# EAGLE schematic POVRotor (EAGLE 8.4.1)
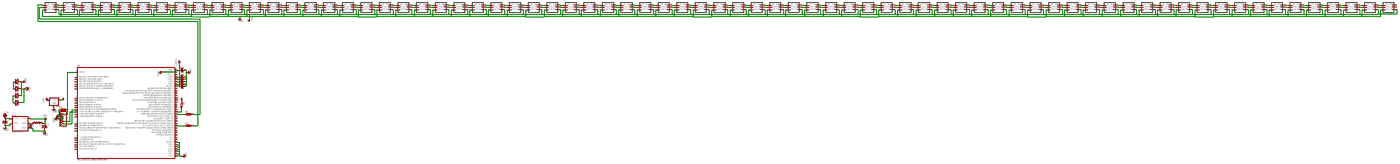
[diagram p0: schematic, sheet 1, overview]
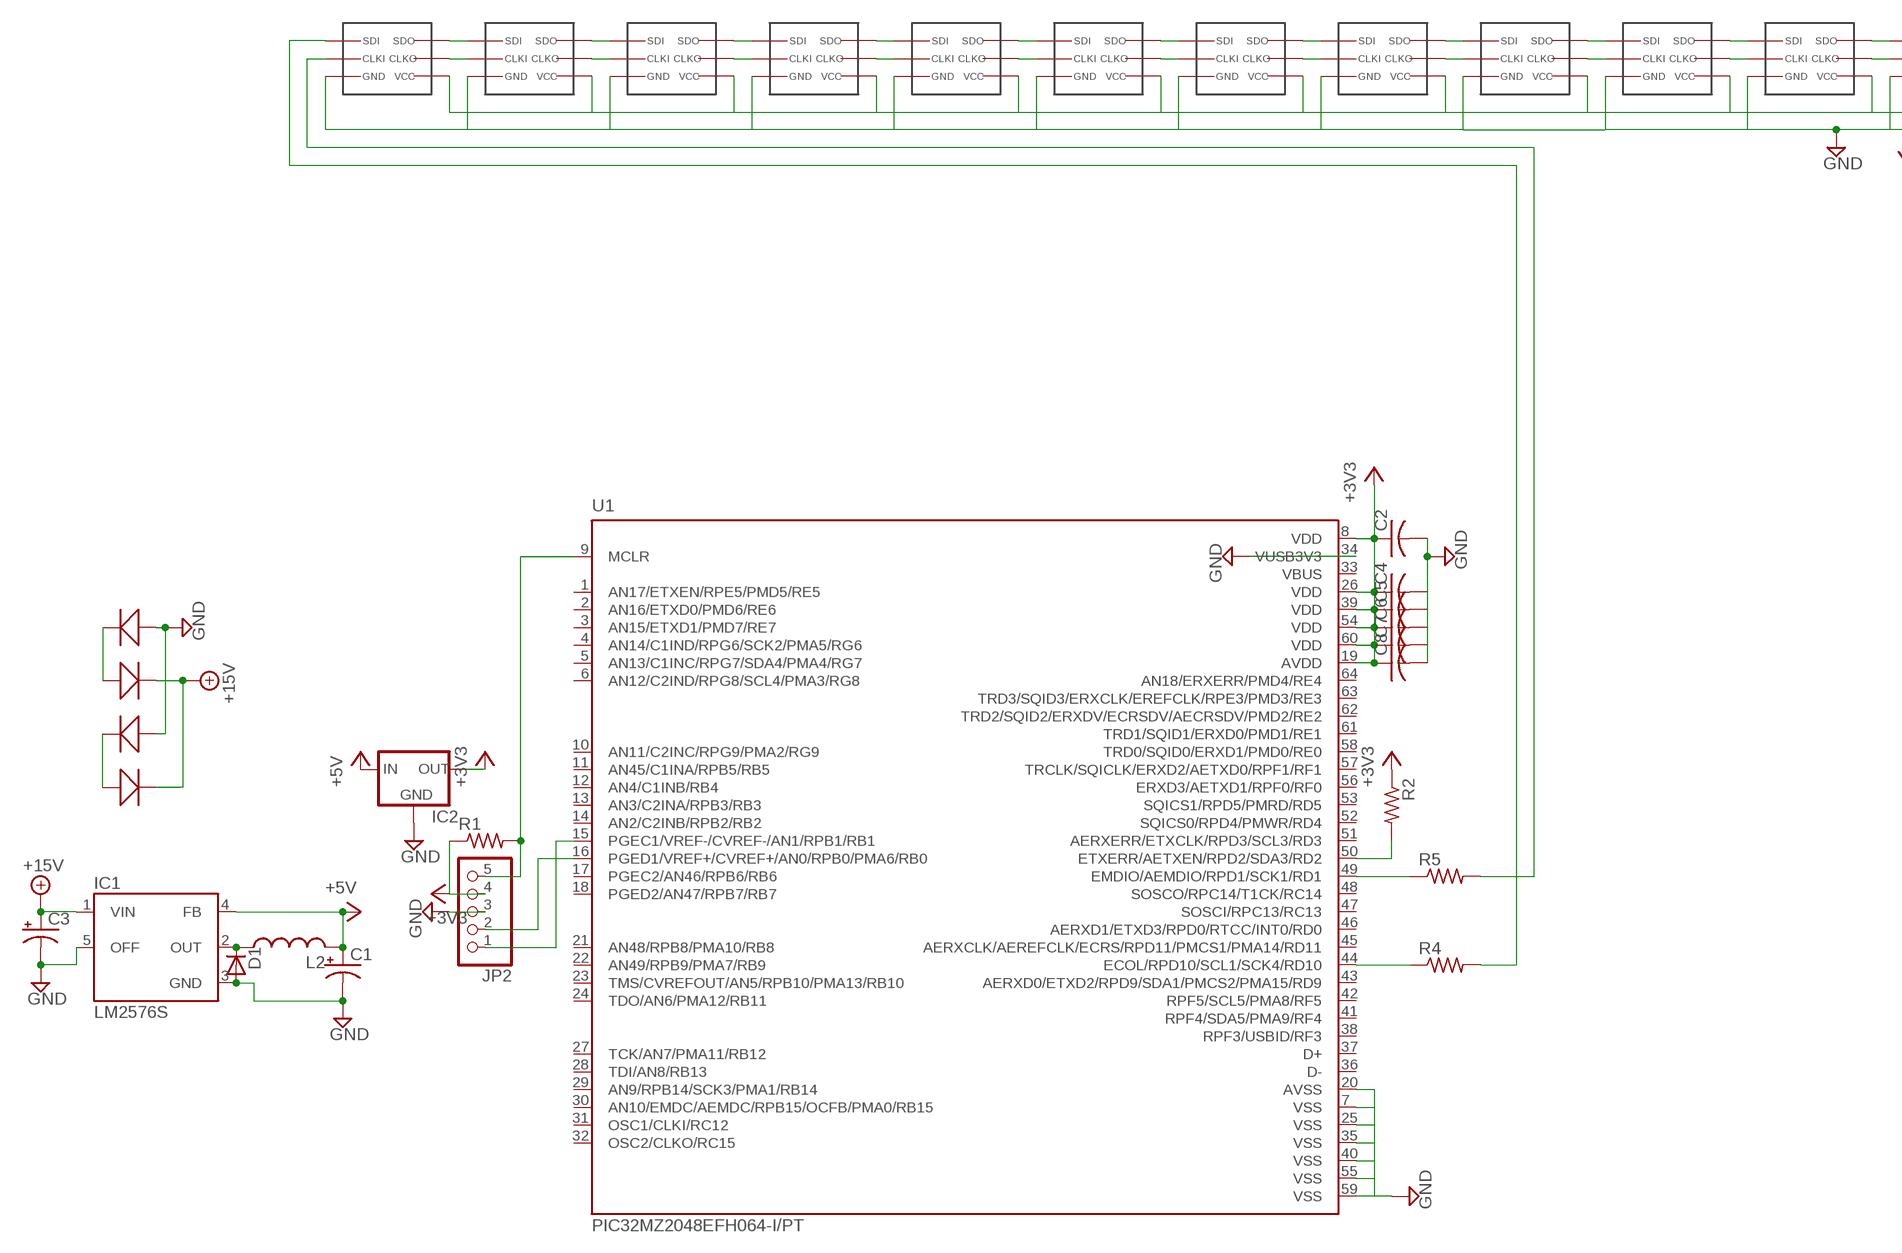
[diagram p1: schematic, sheet 1, part 1 of 8]
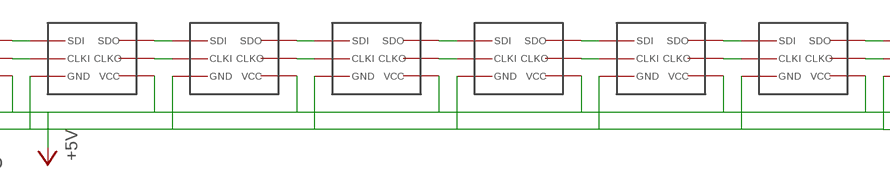
[diagram p2: schematic, sheet 1, part 2 of 8]
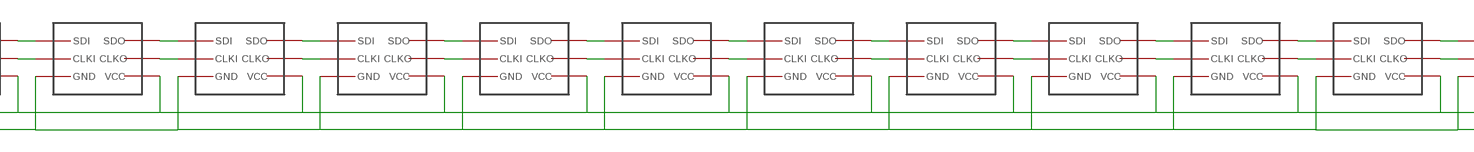
[diagram p3: schematic, sheet 1, part 3 of 8]
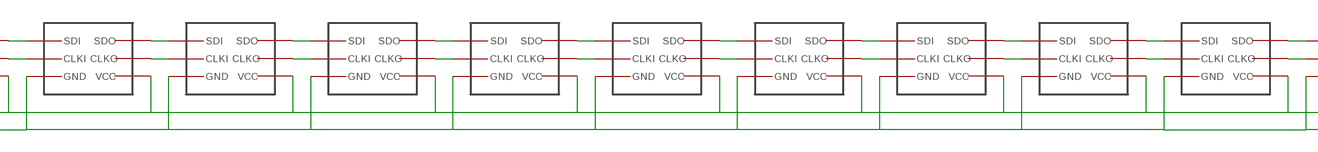
[diagram p4: schematic, sheet 1, part 4 of 8]
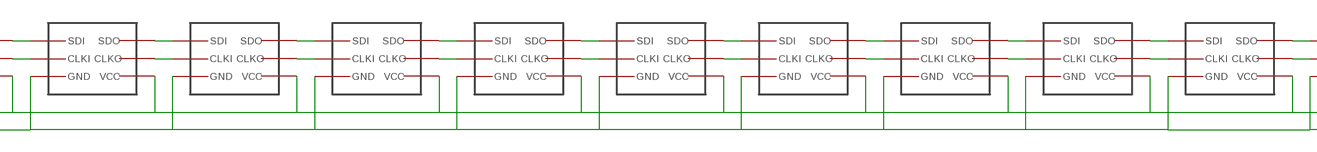
[diagram p5: schematic, sheet 1, part 5 of 8]
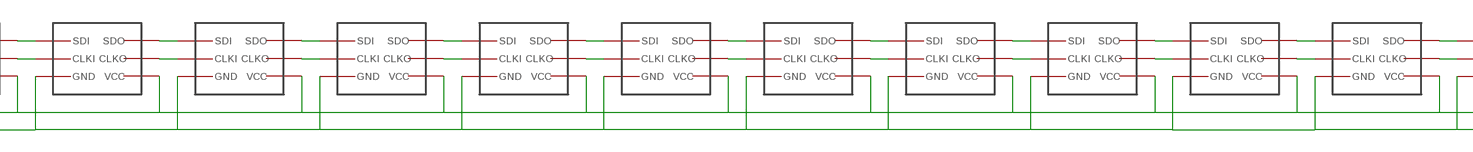
[diagram p6: schematic, sheet 1, part 6 of 8]
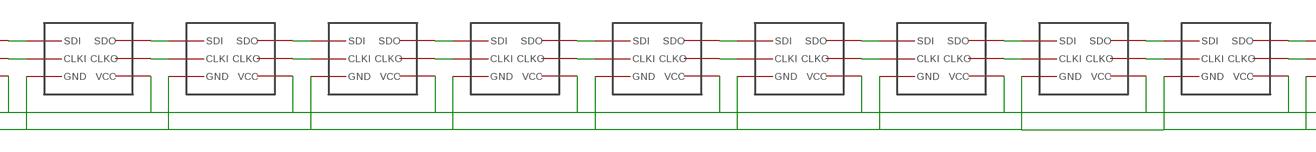
[diagram p7: schematic, sheet 1, part 7 of 8]
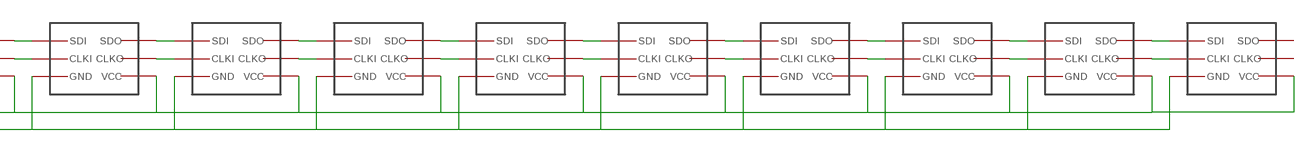
[diagram p8: schematic, sheet 1, part 8 of 8]

## Parts
C1  CPOL-USE2,5-6E  [E2,5-6E]
C2  C-USC0805  [C0805]
C3  CPOL-USE2,5-6E  [E2,5-6E]
C4  C-USC0805  [C0805]
C5  C-USC0805  [C0805]
C6  C-USC0805  [C0805]
C7  C-USC0805  [C0805]
C8  C-USC0805  [C0805]
D1  BYS10  [SOD106A]
D2  SMD-DIODE-SCHOTTKY-40V-3A(DO-214AB)  [DO-214AB]
D3  SMD-DIODE-SCHOTTKY-40V-3A(DO-214AB)  [DO-214AB]
D4  SMD-DIODE-SCHOTTKY-40V-3A(DO-214AB)  [DO-214AB]
D5  SMD-DIODE-SCHOTTKY-40V-3A(DO-214AB)  [DO-214AB]
IC1  LM2576S  [TO263-5]
IC2  LM1117  [SOT223]
JP2  PINHD-1X5  [1X05]
L2  L-USL4532P  [L4532P]
R1  R-US_R0805  [R0805]
R2  R-US_R0603  [R0603]
R4  R-US_R0603  [R0603]
R5  R-US_R0603  [R0603]
U1  PIC32MZ2048EFH064-I/PT  [QFP50P1200X1200X120-64N]
U$1  2020LED  [2020LED]
U$2  2020LED  [2020LED]
U$3  2020LED  [2020LED]
U$4  2020LED  [2020LED]
U$5  2020LED  [2020LED]
U$6  2020LED  [2020LED]
U$7  2020LED  [2020LED]
U$8  2020LED  [2020LED]
U$9  2020LED  [2020LED]
U$10  2020LED  [2020LED]
U$11  2020LED  [2020LED]
U$12  2020LED  [2020LED]
U$13  2020LED  [2020LED]
U$14  2020LED  [2020LED]
U$15  2020LED  [2020LED]
U$16  2020LED  [2020LED]
U$17  2020LED  [2020LED]
U$18  2020LED  [2020LED]
U$19  2020LED  [2020LED]
U$20  2020LED  [2020LED]
U$21  2020LED  [2020LED]
U$22  2020LED  [2020LED]
U$23  2020LED  [2020LED]
U$24  2020LED  [2020LED]
U$25  2020LED  [2020LED]
U$26  2020LED  [2020LED]
U$27  2020LED  [2020LED]
U$28  2020LED  [2020LED]
U$29  2020LED  [2020LED]
U$30  2020LED  [2020LED]
U$31  2020LED  [2020LED]
U$32  2020LED  [2020LED]
U$33  2020LED  [2020LED]
U$34  2020LED  [2020LED]
U$35  2020LED  [2020LED]
U$36  2020LED  [2020LED]
U$37  2020LED  [2020LED]
U$38  2020LED  [2020LED]
U$39  2020LED  [2020LED]
U$40  2020LED  [2020LED]
U$41  2020LED  [2020LED]
U$42  2020LED  [2020LED]
U$43  2020LED  [2020LED]
U$44  2020LED  [2020LED]
U$45  2020LED  [2020LED]
U$46  2020LED  [2020LED]
U$47  2020LED  [2020LED]
U$48  2020LED  [2020LED]
U$49  2020LED  [2020LED]
U$50  2020LED  [2020LED]
U$51  2020LED  [2020LED]
U$52  2020LED  [2020LED]
U$53  2020LED  [2020LED]
U$54  2020LED  [2020LED]
U$55  2020LED  [2020LED]
U$56  2020LED  [2020LED]
U$57  2020LED  [2020LED]
U$58  2020LED  [2020LED]
U$59  2020LED  [2020LED]
U$60  2020LED  [2020LED]
U$61  2020LED  [2020LED]
U$62  2020LED  [2020LED]
U$63  2020LED  [2020LED]
U$64  2020LED  [2020LED]
U$65  2020LED  [2020LED]
U$66  2020LED  [2020LED]
U$67  2020LED  [2020LED]
U$68  2020LED  [2020LED]
U$69  2020LED  [2020LED]
U$70  2020LED  [2020LED]
U$71  2020LED  [2020LED]
U$72  2020LED  [2020LED]
U$73  2020LED  [2020LED]

## Nets
+3V3: C2.1 C4.1 C5.1 C6.1 C7.1 C8.1 IC2.2(OUT) JP2.4 R1.1 R2.1 U1.8(VDD) U1.19(AVDD) U1.26(VDD) U1.39(VDD) U1.54(VDD) U1.60(VDD)
+5V: C1.+ IC1.4(FB) IC2.3(IN) L2.2 U$1.VCC U$2.VCC U$3.VCC U$4.VCC U$5.VCC U$6.VCC U$7.VCC U$8.VCC U$9.VCC U$10.VCC U$11.VCC U$12.VCC U$13.VCC U$14.VCC U$15.VCC U$16.VCC U$17.VCC U$18.VCC U$19.VCC U$20.VCC U$21.VCC U$22.VCC U$23.VCC U$24.VCC U$25.VCC U$26.VCC U$27.VCC U$28.VCC U$29.VCC U$30.VCC U$31.VCC U$32.VCC U$33.VCC U$34.VCC U$35.VCC U$36.VCC U$37.VCC U$38.VCC U$39.VCC U$40.VCC U$41.VCC U$42.VCC U$43.VCC U$44.VCC U$45.VCC U$46.VCC U$47.VCC U$48.VCC U$49.VCC U$50.VCC U$51.VCC U$52.VCC U$53.VCC U$54.VCC U$55.VCC U$56.VCC U$57.VCC U$58.VCC U$59.VCC U$60.VCC U$61.VCC U$62.VCC U$63.VCC U$64.VCC U$65.VCC U$66.VCC U$67.VCC U$68.VCC U$69.VCC U$70.VCC U$71.VCC U$72.VCC U$73.VCC
+15V: C3.+ D2.2(-) D3.2(-) IC1.1(VIN)
GND: C1.- C2.2 C3.- C4.2 C5.2 C6.2 C7.2 C8.2 D1.A D4.1(+) D5.1(+) IC1.3(GND) IC1.5(OFF) IC2.1(GND) JP2.3 U1.7(VSS) U1.20(AVSS) U1.25(VSS) U1.34(VUSB3V3) U1.35(VSS) U1.40(VSS) U1.55(VSS) U1.59(VSS) U$1.GND U$2.GND U$3.GND U$4.GND U$5.GND U$6.GND U$7.GND U$8.GND U$9.GND U$10.GND U$11.GND U$12.GND U$13.GND U$14.GND U$15.GND U$16.GND U$17.GND U$18.GND U$19.GND U$20.GND U$21.GND U$22.GND U$23.GND U$24.GND U$25.GND U$26.GND U$27.GND U$28.GND U$29.GND U$30.GND U$31.GND U$32.GND U$33.GND U$34.GND U$35.GND U$36.GND U$37.GND U$38.GND U$39.GND U$40.GND U$41.GND U$42.GND U$43.GND U$44.GND U$45.GND U$46.GND U$47.GND U$48.GND U$49.GND U$50.GND U$51.GND U$52.GND U$53.GND U$54.GND U$55.GND U$56.GND U$57.GND U$58.GND U$59.GND U$60.GND U$61.GND U$62.GND U$63.GND U$64.GND U$65.GND U$66.GND U$67.GND U$68.GND U$69.GND U$70.GND U$71.GND U$72.GND U$73.GND
N$1: D2.1(+) D5.2(-)
N$2: D3.1(+) D4.2(-)
N$3: D1.K IC1.2(OUT) L2.1
N$5: R2.2 U1.50(ETXERR/AETXEN/RPD2/SDA3/RD2)
N$6: U$1.SDI U$2.SDO
N$7: U$10.SDO U$11.SDI
N$8: U$10.CLKO U$11.CLKI
N$9: U$1.CLKI U$2.CLKO
N$11: U$11.SDO U$12.SDI
N$12: JP2.2 U1.16(PGED1/VREF+/CVREF+/AN0/RPB0/PMA6/RB0)
N$13: JP2.1 U1.15(PGEC1/VREF-/CVREF-/AN1/RPB1/RB1)
N$14: JP2.5 R1.2 U1.9(MCLR)
N$16: R4.2 U$2.SDI
N$17: U$1.SDO U$3.SDI
N$18: R5.2 U$2.CLKI
N$19: R5.1 U1.49(EMDIO/AEMDIO/RPD1/SCK1/RD1)
N$20: U$1.CLKO U$3.CLKI
N$21: R4.1 U1.44(ECOL/RPD10/SCL1/SCK4/RD10)
N$24: U$11.CLKO U$12.CLKI
N$25: U$12.SDO U$13.SDI
N$27: U$12.CLKO U$13.CLKI
N$28: U$13.SDO U$14.SDI
N$29: U$3.SDO U$4.SDI
N$30: U$3.CLKO U$4.CLKI
N$31: U$13.CLKO U$14.CLKI
N$32: U$14.SDO U$15.SDI
N$33: U$14.CLKO U$15.CLKI
N$34: U$4.SDO U$5.SDI
N$35: U$4.CLKO U$5.CLKI
N$36: U$15.SDO U$16.SDI
N$37: U$15.CLKO U$16.CLKI
N$38: U$16.SDO U$17.SDI
N$39: U$16.CLKO U$17.CLKI
N$40: U$5.SDO U$6.SDI
N$41: U$5.CLKO U$6.CLKI
N$42: U$17.SDO U$18.SDI
N$43: U$17.CLKO U$18.CLKI
N$44: U$18.SDO U$19.SDI
N$45: U$18.CLKO U$19.CLKI
N$46: U$6.SDO U$7.SDI
N$48: U$19.SDO U$20.SDI
N$49: U$19.CLKO U$20.CLKI
N$51: U$20.SDO U$21.SDI
N$52: U$20.CLKO U$21.CLKI
N$53: U$21.SDO U$22.SDI
N$54: U$6.CLKO U$7.CLKI
N$55: U$21.CLKO U$22.CLKI
N$56: U$22.SDO U$23.SDI
N$57: U$22.CLKO U$23.CLKI
N$58: U$23.SDO U$24.SDI
N$59: U$23.CLKO U$24.CLKI
N$60: U$7.SDO U$8.SDI
N$61: U$24.SDO U$25.SDI
N$62: U$7.CLKO U$8.CLKI
N$63: U$24.CLKO U$25.CLKI
N$64: U$25.SDO U$26.SDI
N$65: U$25.CLKO U$26.CLKI
N$66: U$8.SDO U$9.SDI
N$67: U$8.CLKO U$9.CLKI
N$68: U$26.SDO U$27.SDI
N$69: U$26.CLKO U$27.CLKI
N$70: U$9.SDO U$10.SDI
N$71: U$9.CLKO U$10.CLKI
N$72: U$27.SDO U$28.SDI
N$73: U$27.CLKO U$28.CLKI
N$75: U$28.SDO U$29.SDI
N$76: U$28.CLKO U$29.CLKI
N$77: U$29.SDO U$30.SDI
N$78: U$29.CLKO U$30.CLKI
N$79: U$30.SDO U$31.SDI
N$80: U$30.CLKO U$31.CLKI
N$81: U$31.SDO U$32.SDI
N$82: U$31.CLKO U$32.CLKI
N$83: U$32.SDO U$33.SDI
N$84: U$32.CLKO U$33.CLKI
N$85: U$33.SDO U$34.SDI
N$86: U$33.CLKO U$34.CLKI
N$87: U$34.SDO U$35.SDI
N$88: U$34.CLKO U$35.CLKI
N$89: U$35.SDO U$36.SDI
N$90: U$35.CLKO U$36.CLKI
N$91: U$36.SDO U$37.SDI
N$92: U$36.CLKO U$37.CLKI
N$93: U$37.SDO U$38.SDI
N$94: U$37.CLKO U$38.CLKI
N$96: U$38.SDO U$39.SDI
N$97: U$38.CLKO U$39.CLKI
N$98: U$39.SDO U$40.SDI
N$99: U$39.CLKO U$40.CLKI
N$100: U$40.SDO U$41.SDI
N$101: U$40.CLKO U$41.CLKI
N$102: U$41.SDO U$42.SDI
N$103: U$41.CLKO U$42.CLKI
N$104: U$42.SDO U$43.SDI
N$105: U$42.CLKO U$43.CLKI
N$106: U$43.SDO U$44.SDI
N$107: U$43.CLKO U$44.CLKI
N$108: U$44.SDO U$45.SDI
N$109: U$44.CLKO U$45.CLKI
N$110: U$45.SDO U$46.SDI
N$111: U$45.CLKO U$46.CLKI
N$113: U$46.SDO U$47.SDI
N$114: U$46.CLKO U$47.CLKI
N$115: U$47.SDO U$48.SDI
N$116: U$47.CLKO U$48.CLKI
N$117: U$48.SDO U$49.SDI
N$118: U$48.CLKO U$49.CLKI
N$119: U$49.SDO U$50.SDI
N$120: U$49.CLKO U$50.CLKI
N$121: U$50.SDO U$51.SDI
N$122: U$50.CLKO U$51.CLKI
N$123: U$51.SDO U$52.SDI
N$124: U$51.CLKO U$52.CLKI
N$125: U$52.SDO U$53.SDI
N$126: U$52.CLKO U$53.CLKI
N$127: U$53.SDO U$54.SDI
N$128: U$53.CLKO U$54.CLKI
N$129: U$54.SDO U$55.SDI
N$130: U$54.CLKO U$55.CLKI
N$131: U$55.SDO U$56.SDI
N$132: U$55.CLKO U$56.CLKI
N$133: U$56.SDO U$57.SDI
N$134: U$56.CLKO U$57.CLKI
N$135: U$57.SDO U$58.SDI
N$136: U$57.CLKO U$58.CLKI
N$137: U$58.SDO U$59.SDI
N$138: U$58.CLKO U$59.CLKI
N$139: U$59.SDO U$60.SDI
N$140: U$59.CLKO U$60.CLKI
N$141: U$60.SDO U$61.SDI
N$142: U$60.CLKO U$61.CLKI
N$143: U$61.SDO U$62.SDI
N$144: U$61.CLKO U$62.CLKI
N$145: U$62.SDO U$63.SDI
N$146: U$62.CLKO U$63.CLKI
N$147: U$63.SDO U$64.SDI
N$148: U$63.CLKO U$64.CLKI
N$149: U$64.SDO U$65.SDI
N$150: U$64.CLKO U$65.CLKI
N$151: U$65.SDO U$66.SDI
N$152: U$65.CLKO U$66.CLKI
N$153: U$66.SDO U$67.SDI
N$154: U$66.CLKO U$67.CLKI
N$155: U$67.SDO U$68.SDI
N$156: U$67.CLKO U$68.CLKI
N$157: U$68.SDO U$69.SDI
N$158: U$68.CLKO U$69.CLKI
N$159: U$69.SDO U$70.SDI
N$160: U$69.CLKO U$70.CLKI
N$161: U$70.SDO U$71.SDI
N$162: U$70.CLKO U$71.CLKI
N$163: U$71.SDO U$72.SDI
N$164: U$71.CLKO U$72.CLKI
N$165: U$72.SDO U$73.SDI
N$166: U$72.CLKO U$73.CLKI
Unconnected: U1.1(AN17/ETXEN/RPE5/PMD5/RE5) U1.2(AN16/ETXD0/PMD6/RE6) U1.3(AN15/ETXD1/PMD7/RE7) U1.4(AN14/C1IND/RPG6/SCK2/PMA5/RG6) U1.5(AN13/C1INC/RPG7/SDA4/PMA4/RG7) U1.6(AN12/C2IND/RPG8/SCL4/PMA3/RG8) U1.10(AN11/C2INC/RPG9/PMA2/RG9) U1.11(AN45/C1INA/RPB5/RB5) U1.12(AN4/C1INB/RB4) U1.13(AN3/C2INA/RPB3/RB3) U1.14(AN2/C2INB/RPB2/RB2) U1.17(PGEC2/AN46/RPB6/RB6) U1.18(PGED2/AN47/RPB7/RB7) U1.21(AN48/RPB8/PMA10/RB8) U1.22(AN49/RPB9/PMA7/RB9) U1.23(TMS/CVREFOUT/AN5/RPB10/PMA13/RB10) U1.24(TDO/AN6/PMA12/RB11) U1.27(TCK/AN7/PMA11/RB12) U1.28(TDI/AN8/RB13) U1.29(AN9/RPB14/SCK3/PMA1/RB14) U1.30(AN10/EMDC/AEMDC/RPB15/OCFB/PMA0/RB15) U1.31(OSC1/CLKI/RC12) U1.32(OSC2/CLKO/RC15) U1.36(D-) U1.37(D+) U1.38(RPF3/USBID/RF3) U1.41(RPF4/SDA5/PMA9/RF4) U1.42(RPF5/SCL5/PMA8/RF5) U1.43(AERXD0/ETXD2/RPD9/SDA1/PMCS2/PMA15/RD9) U1.45(AERXCLK/AEREFCLK/ECRS/RPD11/PMCS1/PMA14/RD11) U1.46(AERXD1/ETXD3/RPD0/RTCC/INT0/RD0) U1.47(SOSCI/RPC13/RC13) U1.48(SOSCO/RPC14/T1CK/RC14) U1.51(AERXERR/ETXCLK/RPD3/SCL3/RD3) U1.52(SQICS0/RPD4/PMWR/RD4) U1.53(SQICS1/RPD5/PMRD/RD5) U1.56(ERXD3/AETXD1/RPF0/RF0) U1.57(TRCLK/SQICLK/ERXD2/AETXD0/RPF1/RF1) U1.58(TRD0/SQID0/ERXD1/PMD0/RE0) U1.61(TRD1/SQID1/ERXD0/PMD1/RE1) U1.62(TRD2/SQID2/ERXDV/ECRSDV/AECRSDV/PMD2/RE2) U1.63(TRD3/SQID3/ERXCLK/EREFCLK/RPE3/PMD3/RE3) U1.64(AN18/ERXERR/PMD4/RE4) U$73.CLKO U$73.SDO

## Power pins joined to a net without a drawn wire
VBUS: U1.33(VBUS)

## Library data of the parts
C1 C3 = resistor:CPOL-US: POLARIZED CAPACITOR, American symbol
C2 C4-C8 = resistor:C-US: CAPACITOR, American symbol
D1 = telefunken:BYS10: DIODE; MPN: BYS10/45; OC_FARNELL: 9549188; OC_NEWARK: 96K7236
D2-D5 = SMD-DIODE-SCHOTTKY-40V-3A_DO-214AB_:SMD-DIODE-SCHOTTKY-40V-3A(DO-214AB): 304020018; AVAILABILITY: Good; DESCRIPTION: Rectifier%2C Schottky%3B DO-214AB%3B 3.0A IF%3B 0.75V%3B 40V%3B 100A IFRM%3B 10000V/us%3B 1000pF; MF: Vishay; MP: SS34-E3/57T; PACKAGE: DO-214 Vishay; PRICE: 0.24 USD
IC1 = lm2576:LM2576: National Semiconductor <http://www.national.com> 3.0A "Simple Switcher"(c) 52kHz, Vout 1.23-37V (HV: 57V), Vin 40V (HV: 60V), 50µA standby current
IC2 = lm2576:LM1117
JP2 = pinhead:PINHD-1X5: PIN HEADER
L2 = resistor:L-US: INDUCTOR, American symbol
R1 R2 R4 R5 = resistor:R-US_: RESISTOR, American symbol
U1 = PIC32MZ2048EFH064-I_PT:PIC32MZ2048EFH064-I/PT: PIC32MZ Series 2 MB Flash 512 kB RAM 200 MHz 32-Bit Microcontroller - TQFP-64; AVAILABILITY: Good; DESCRIPTION: PIC32MZ Series 2 MB Flash 512 kB RAM 200 MHz 32-Bit Microcontroller - TQFP-64; MF: Microchip; MP: PIC32MZ2048EFH064-I/PT; PACKAGE: TQFP-64 Microchip; PRICE: 11.29 USD
U$1-U$73 = APA2020:2020LED